# Altium schematic sheet XC4216_DC_DC3.3V.SchDoc
size A; SheetNumber: 2; SheetTotal: 3
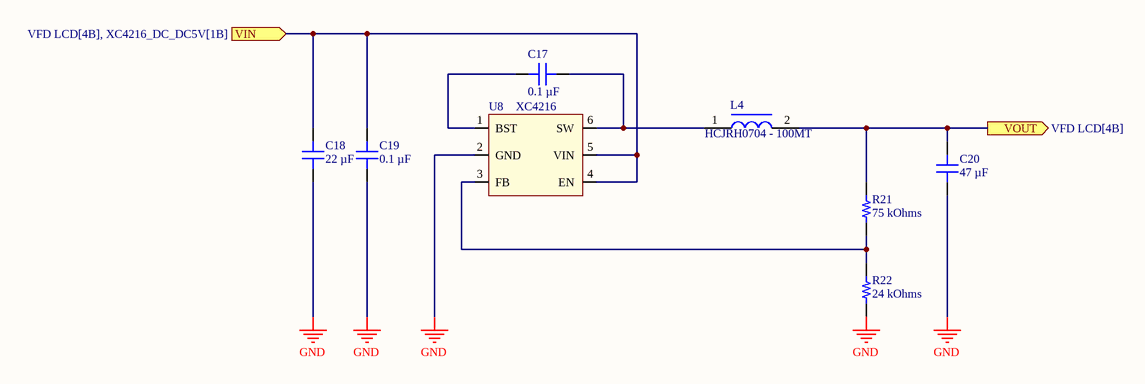
[diagram p0: XC4216_DC_DC3.3V.SchDoc]

## Parts
C17  0.1 µF  [CAP 0805_2012]
C18  22 µF  [CAP 0805_2012]
C19  0.1 µF  [CAP 0805_2012]
C20  47 µF  [CAP 0805_2012]
L4  HCJRH0704 - 100MT  [HCJRH0704 - 100MT]
R21  75 kOhms  [RES 0805_2012]
R22  24 kOhms  [RES 0805_2012]
U8  XC4216  [SOT-23-6]

## Ports
VIN (in, see VFD LCD[4B], XC4216_DC_DC5V[1B]), VOUT (out, see VFD LCD[4B])

## Nets
GND: C18.1 C19.1 C20.1 R22.1 U8.2(GND)
VIN: C18.2 C19.2 U8.4(EN) U8.5(VIN) ; port VIN
VOUT: C20.2 L4.2 R21.2 ; port VOUT
NetC17_1: C17.1 U8.1(BST)
NetC17_2: C17.2 L4.1 U8.6(SW)
NetR21_1: R21.1 R22.2 U8.3(FB)

## Library data of the parts
C17 C19 = CC0805MRX7R9BB104: CAP CER 0.1UF 50V X7R 0805; manufacturer: Yageo; Tolerance: ±20%; Part Number: CC0805MRX7R9BB104; Value: 0.1 µF; Applications: General Purpose; Capacitance: 0.1 µF; componentlink1description: Datasheet; componentlink1url: https://www.yageo.com/upload/media/product/productsearch/datasheet/mlcc/UPY-GPHC_X7R_6.3V-to-50V_18.pdf; componentlink2description: DigiKey Link; componentlink2url: https://www.digikey.com/en/products/detail/yageo/CC0805MRX7R9BB104/5884281; Device Package: 0805 (2012 Metric); lastupdated: 8/26/2023 7:12:59 PM; Lifecycle Status: Active; Minimum Order: 1; Mounting Type: Surface Mount, MLCC; Operating Temperature: -55°C ~ 125°C; Package / Case: 0805 (2012 Metric); packaging: TapeAndReel; partid: 2475; Part Status: Active; price: 0.01; series: CC; Size / Dimension: 0.079" L x 0.049" W (2.00mm x 1.25mm); Supplier 1: DigiKey; Supplier Part Number 1: 311-4351-1-ND; Temperature Coefficient: X7R; Thickness (Max): 0.037" (0.95mm); Voltage - Rated: 50V
C18 = C2012X6S0J226M125AB: CAP CER 22UF 6.3V X6S 0805; manufacturer: TDK Corporation; Tolerance: ±20%; Part Number: C2012X6S0J226M125AB; Value: 22 µF; Applications: General Purpose; Capacitance: 22 µF; componentlink1description: Datasheet; componentlink1url: https://product.tdk.com/info/en/catalog/datasheets/mlcc_commercial_general_en.pdf?ref_disty=digikey; componentlink2description: DigiKey Link; componentlink2url: https://www.digikey.com/en/products/detail/tdk-corporation/C2012X6S0J226M125AB/2733055; Device Package: 0805 (2012 Metric); Features: Low ESL; lastupdated: 8/26/2023 7:12:49 PM; Lifecycle Status: Active; Minimum Order: 1; Mounting Type: Surface Mount, MLCC; Operating Temperature: -55°C ~ 105°C; Package / Case: 0805 (2012 Metric); packaging: TapeAndReel; partid: 3393; Part Status: Active; price: 0.13; series: C; Size / Dimension: 0.079" L x 0.049" W (2.00mm x 1.25mm); Supplier 1: DigiKey; Supplier Part Number 1: 445-7620-1-ND; Temperature Coefficient: X6S; Thickness (Max): 0.057" (1.45mm); Voltage - Rated: 6.3V
C20 = AMK212BBJ476MD-T: CAP CER 47UF 4V X5R 0805; manufacturer: Taiyo Yuden; Tolerance: ±20%; Part Number: AMK212BBJ476MD-T; Value: 47 µF; Applications: SMPS Filtering; Capacitance: 47 µF; componentlink1description: Datasheet; componentlink1url: https://ds.yuden.co.jp/TYCOMPAS/ut/detail?pn=AMK212BBJ476MD-T &u=M; componentlink2description: DigiKey Link; componentlink2url: https://www.digikey.com/en/products/detail/taiyo-yuden/AMK212BBJ476MD-T/7066986; Device Package: 0805 (2012 Metric); lastupdated: 8/26/2023 7:12:50 PM; Lifecycle Status: Active; Minimum Order: 1; Mounting Type: Surface Mount, MLCC; Operating Temperature: -55°C ~ 85°C; Package / Case: 0805 (2012 Metric); packaging: TapeAndReel; partid: 3321; Part Status: Active; price: 0.12; series: M; Size / Dimension: 0.079" L x 0.049" W (2.00mm x 1.25mm); Supplier 1: DigiKey; Supplier Part Number 1: 587-5399-1-ND; Temperature Coefficient: X5R; Thickness (Max): 0.037" (0.95mm); Voltage - Rated: 4V
L4 = HCJRH0704 - 100MT: Inductor 10UH
R21 = RMCF0805FT75K0: RES 75K OHM 1% 1/8W 0805; Manufacturer: Stackpole Electronics Inc; Power (Watts): 0.125W, 1/8W; Temperature Coefficient: ±100ppm/°C; Part Number: RMCF0805FT75K0; Value: 75 kOhms; ComponentLink1Description: Datasheet; ComponentLink1URL: https://www.seielect.com/catalog/sei-packaging.pdf; ComponentLink2Description: DigiKey Link; ComponentLink2URL: https://www.digikey.com/en/products/detail/stackpole-electronics-inc/RMCF0805FT75K0/1760535; Composition: Thick Film; Device Package: 0805 (2012 Metric); Features: Automotive AEC-Q200; Height - Seated (Max): 0.026" (0.65mm); LastUpdated: 8/26/2023 7:54:04 PM; Lifecycle Status: Active; Minimum Order: 1; Number of Terminations: 2; Operating Temperature: -55°C ~ 155°C; Package / Case: 0805 (2012 Metric); Packaging: CutTape; PartId: 32475; Part Status: Active; Price: 0.01; Ratings: AEC-Q200; Resistance: 75 kOhms; Series: RMCF; Size / Dimension: 0.079" L x 0.049" W (2.00mm x 1.25mm); Supplier 1: DigiKey; Supplier Part Number 1: RMCF0805FT75K0CT-ND; Supplier Device Package: 0805; Tolerance: ±1%
R22 = TNPW080524K0BEEA: RES 24K OHM 0.1% 1/8W 0805; Manufacturer: Vishay Dale; Power (Watts): 0.125W, 1/8W; Temperature Coefficient: ±25ppm/°C; Part Number: TNPW080524K0BEEA; Value: 24 kOhms; ComponentLink1Description: Datasheet; ComponentLink1URL: http://www.vishay.com/docs/28758/tnpw_e3.pdf; ComponentLink2Description: DigiKey Link; ComponentLink2URL: https://www.digikey.com/en/products/detail/vishay-dale/TNPW080524K0BEEA/1607437; Composition: Thin Film; Device Package: 0805 (2012 Metric); Features: Anti-Sulfur, Automotive AEC-Q200, Moisture Resistant; Height - Seated (Max): 0.022" (0.55mm); LastUpdated: 8/26/2023 7:53:42 PM; Lifecycle Status: Active; Minimum Order: 1; Number of Terminations: 2; Operating Temperature: -55°C ~ 155°C; Package / Case: 0805 (2012 Metric); Packaging: TapeAndReel; PartId: 37819; Part Status: Active; Price: 0.16; Ratings: AEC-Q200; Resistance: 24 kOhms; Series: TNPW e3; Size / Dimension: 0.079" L x 0.049" W (2.00mm x 1.25mm); Supplier 1: DigiKey; Supplier Part Number 1: 541-9860-1-ND; Supplier Device Package: 0805; Tolerance: ±0.1%